# Altium schematic sheet Driver_Esq.SchDoc
size A4; SheetNumber: 1; SheetTotal: 1
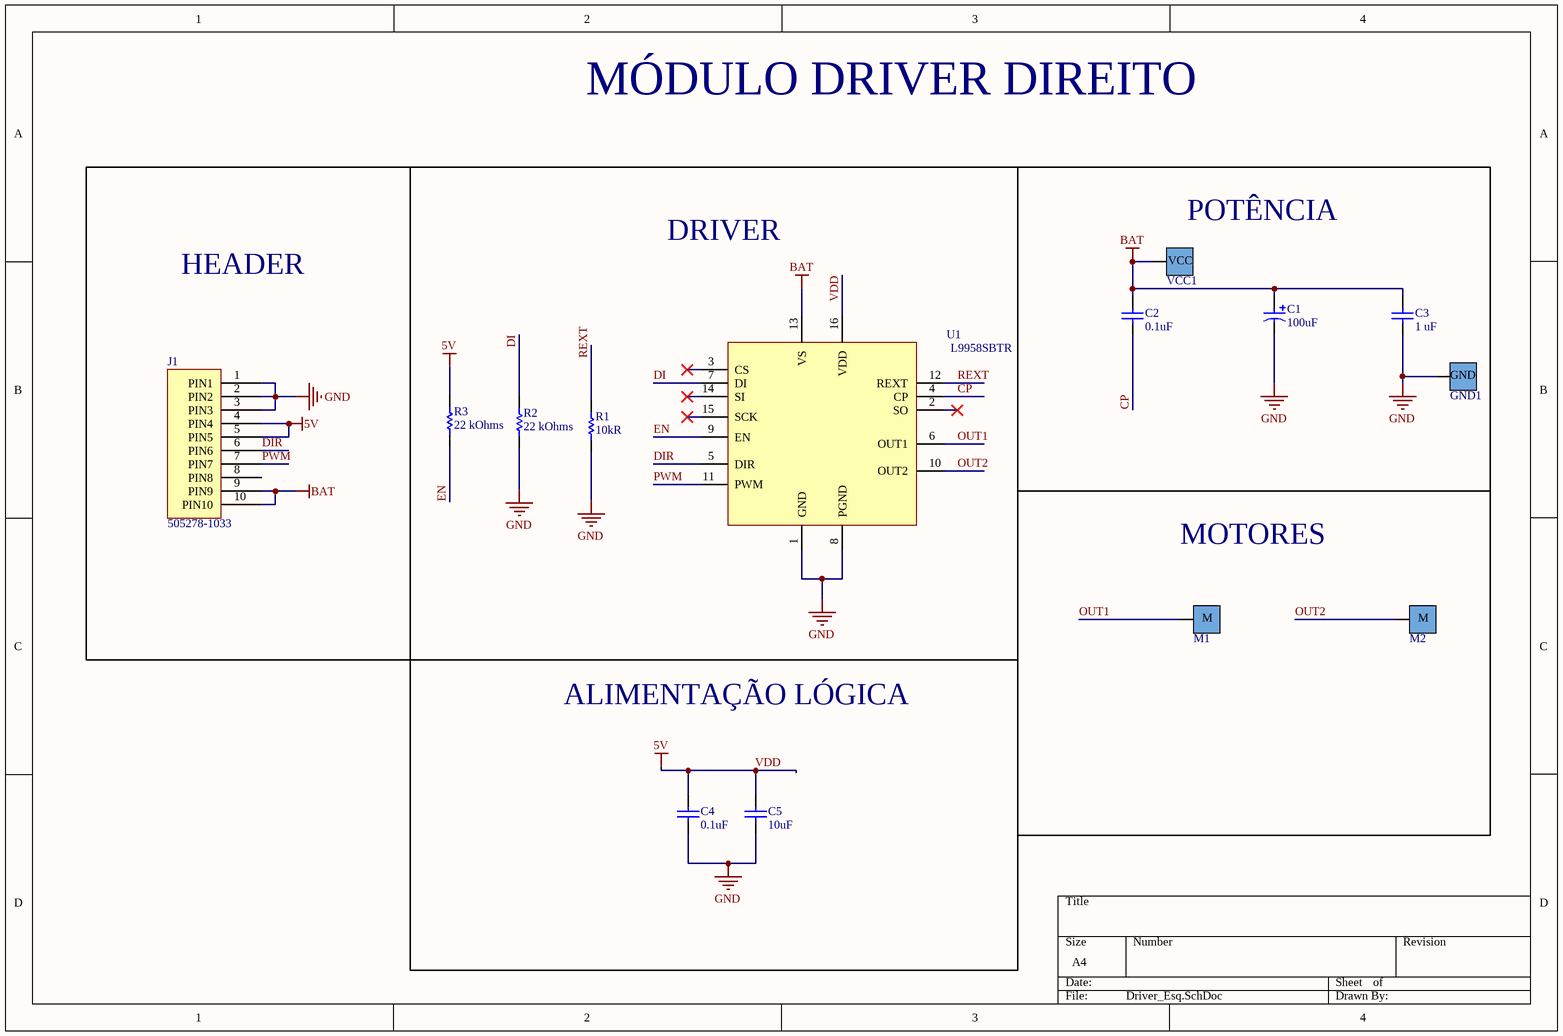
[diagram p0: Driver_Esq.SchDoc]

## Parts
C1  100uF  [TANTALUM C0805]
C2  0.1uF  [C0805]
C3  1 uF  [C0805]
C4  0.1uF  [C0805]
C5  10uF  [C0805]
GND1  Ground Pad  [PAD_ALIMENTAÇÃO_MINI]  (value not drawn)
J1  505278-1033  [FPC_CON]
M1  Motor Pad  [PAD_MOTOR_MINI]  (value not drawn)
M2  Motor Pad  [PAD_MOTOR_MINI]  (value not drawn)
R1  10kR  [RESISTOR_0603]
R2  22 kOhms  [RESISTOR_0603]
R3  22 kOhms  [RESISTOR_0603]
U1  L9958SBTR  [POWERSO16 (16_PINS)]
VCC1  Source Pad  [PAD_ALIMENTAÇÃO_MINI]  (value not drawn)

## Blocks framed on the sheet
MOTORES: M1 M2
ALIMENTAÇÃO LÓGICA: C4 C5

## Nets
BAT: C1.1 C2.1 C3.2 J1.9(PIN9) J1.10(PIN10) U1.13(VS) VCC1.A(VCC)
GND: C1.2 C3.1 C4.2 C5.1 GND1.A(GND) J1.1(PIN1) J1.2(PIN2) J1.3(PIN3) R1.1 R2.1 U1.1(GND) U1.8(PGND)
VDD: C4.1 C5.2 J1.4(PIN4) J1.5(PIN5) R3.1 U1.16(VDD)  [also labelled 5V]
CP: C2.2 U1.4(CP)
DI: R2.2 U1.7(DI)
DIR: J1.6(PIN6) U1.5(DIR)
EN: R3.2 U1.9(EN)
OUT1: M1.M U1.6(OUT1)
OUT2: M2.M U1.10(OUT2)
PWM: J1.7(PIN7) U1.11(PWM)
REXT: R1.2 U1.12(REXT)

Not connected (* = marked no-connect by the designer): J1 8(PIN8); U1 2(SO)* 3(CS)* 14(SI)* 15(SCK)*

## Notes on the sheet
- MÓDULO DRIVER DIREITO
- DRIVER
- (near VCC1) POTÊNCIA
- HEADER

## Library data of the parts
C1 = F980J107MSA: CAP TAN 100uF 6.3V 0805; Manufacturer: AVX; Tolerance: 20%; ESR: 8 Ohms using (100kHz); Dieletric: Tantalum; Library Control - Checked Footprint: Yes; Library Control - Person that Checked Footprint: Nikaum; Supplier 1: Mouser; Part Number: F980J107MSA; Category: Tantalum Capacitor; Price: 1=0.87, 10=0.646, 100=0.443 (USD); Supplier Part Number 1: 581-F980J107MSA; Library Ref: Capacitor; Operating Temperature: -55 C ~ 125 C; Package / Case: 0805 (2012 Metric); Size / Dimension: 2,00 L x 1,25 W x 0,80 H; Value: 100uF; Voltage - Rated: 6.3V; Library Control - Checked Schematic: Yes; Library Control - Last Update: 27/06/2021 23:37; Library Control - Person that Checked Schematic: Nikaum; Library Control - Person that did the Last Update Footprint: Nikaum; Library Control - Person that did the Last Update Schematic: Nikaum; ComponentLink1Description: Datasheet; ComponentLink1URL: https://br.mouser.com/datasheet/2/40/AVX_F98%20DTSH%2008_16-1158749.pdf; ComponentLink2Description: Mouser Link; ComponentLink2URL: https://br.mouser.com/ProductDetail/AVX/F980J107MSA?qs=%2Fha2pyFaduiqmyJM1RWxJ6tWf%252BqxluChd36%252Bz6k56%252ByF7CmEPS5MIQ%3D%3D
C2 C4 = C0805C104M3RACTU: CAP CER 100nF 25V X7R 0805; Manufacturer: Kemet; Tolerance: 20%; Voltage - Rated: 25 VDC; Library Control - Checked Footprint: Yes; Library Control - Person that Checked Footprint: Cage; Supplier 1: Mouser; Part Number: C0805C104M3RACTU; Category: Ceramic Capacitor; Price: 1=0,13 10=0,064 100=0,037 1000=0,025 (USD); Supplier Part Number 1: 80-C0805C104M3R; Library Ref: Capacitor; Operating Temperature: -55 C ~ 125 C; Package / Case: 0805(2012 mestric); Size / Dimension: 1.25 mm W x 2 mm L x 0.78 mm H; Value: 0.1uF; ESR: -; Dieletric: X7R; Library Control - Checked Schematic: Yes; Library Control - Last Update: 25/08/22; Library Control - Person that Checked Schematic: Cage; Library Control - Person that did the Last Update Footprint: Cage; Library Control - Person that did the Last Update Schematic: Cage; ComponentLink1Description: Datasheet; ComponentLink1URL: https://br.mouser.com/datasheet/2/212/KEM_C1002_X7R_SMD-1102033.pdf; ComponentLink2Description: Mouser Link; ComponentLink2URL: https://br.mouser.com/ProductDetail/KEMET/C0805C104M3RACTU?qs=jbCUrP3sAgSIdMuvv9W4Pg%3D%3D
C3 = 08051C105K4T2A: CAP CER 1uF 100V X7R 0805; Manufacturer: KYOCERA AVX; Tolerance: 10%; Voltage - Rated: 100 VDC; Library Control - Checked Footprint: Yes; Supplier 1: Mouser; Part Number: 08051C105K4T2A; Category: Ceramic capacitor; Price: 1=0,41 10=0,283 100=0,169 1000=0,107 (USD); Supplier Part Number 1: 581-08051C105K4T2A; Library Ref: Capacitor; Operating Temperature: -55°C ~125ºC; Package / Case: 0805(2012 Metric); Size / Dimension: 2 mm L  x 1.25 mm W x 1.25 mm H; Value: 1 uF; ESR: -; Dieletric: X7R; Library Control - Checked Schematic: Yes; ComponentLink1Description: Datasheet; ComponentLink1URL: https://br.mouser.com/datasheet/2/40/AutoMLCC-777028.pdf; ComponentLink2Description: Mouser Link; ComponentLink2URL: https://br.mouser.com/ProductDetail/KYOCERA-AVX/08051C105K4T2A?qs=BZBei1rCqCBHLdlOVwQkfA%3D%3D
C5 = EMK212BB7106MG-T: CAP CER 10uF 16V X7R 0805; Manufacturer: Taiyo Yuden; Tolerance: 20%; Voltage - Rated: 16V DC; Library Control - Checked Footprint: Yes; Library Control - Person that Checked Footprint: Cage; Library Control - Person that did the Last Update Footprint: Chico; Supplier 1: Mouser; Part Number: EMK212BB7106MG-T; Category: Ceramic Capacitors; Price: 1=0.42, 10=0.204, 100=0.175 (USD); Supplier Part Number 1: 963-EMK212BB7106MG-T; Library Ref: Capacitor; Operating Temperature: -55°C~+125°C; Package / Case: 0805; Size / Dimension: 1.25mm X 2mm X 1.45mm; Value: 10uF; Dieletric: X7R; Library Control - Checked Schematic: Yes; Library Control - Last Update: 22/08/22; Library Control - Person that Checked Schematic: Cage; Library Control - Person that did the Last Update Schematic: Cage; ComponentLink1Description: Datasheet; ComponentLink1URL: https://br.mouser.com/datasheet/2/396/mlcc02_e-1307760.pdf; ComponentLink2Description: Mouser Link; ComponentLink2URL: https://br.mouser.com/ProductDetail/Taiyo-Yuden/EMK212BB7106MG-T?qs=sGAEpiMZZMsh%252B1woXyUXj9%252BEWUGdOab8mJU%252BgghcgP8%3D
GND1 = Ground Pad Mini Sumô: GND PAD MINI SUMÔ; Cable AWG: 20 / 18 (AWG); Recomended Category: Mini Sumô; Size: 3.5 x 3.5 (mm); Library Ref: Pads
J1 = 505278-1033_BODY: CONN FFC/FPC HORZ 10POS 0.50MM; Manufacturer: Molex; Current Rating (Amps): 500mA; Number of Positions: 10; Library Control - Checked Footprint: Yes; Library Control - Last Project that Used: Follow-Final; Library Control - Person that Checked Footprint: Lucas; Library Control - Person that did the Last Update Footprint: Mateus(Dimas); Supplier 1: Mouser; Part Number: 505278-1033; Category: Connectors; Price: 1=0,51000, 10=0,42900, 100=0,33400 (USD); Mounting Type: Right Angle; Contact Material: Tin; Operating Temperature: -40°C ~ 85°C; Library Ref: Connectors; Number of Rows: 1; Termination: SMD; Insulation Material: Liquid Crystal Polymer; Contact Type: FFC/FPC; Pitch: 0.50mm; Contact Length - Mating: 0.50mm; Supplier Part Number 1: 538-505278-1033; Library Control - Checked Schematic: Yes; Library Control - Last Update: 24/04/2021 00:25; Library Control - Person that Checked Schematic: Lucas; Library Control - Person that did the Last Update Schematic: Mateus(Dimas); ComponentLink1Description: Datasheet; ComponentLink1URL: https://br.mouser.com/datasheet/2/276/2/5052781033_FFC_FPC_CONNECTORS-772019.pdf; ComponentLink2Description: Mouser Link; ComponentLink2URL: https://br.mouser.com/ProductDetail/Molex/505278-1033?qs=c8NFF48pVsDStgrQCBOSTg%3D%3D
M1 M2 = Motor Pad Mini Sumô: Cable AWG: 20 / 18 (AWG); Recomended Category: Mini Sumô; Size: 3.5 x 3.5 (mm); Library Ref: Pads
R1 = RC0603JR-0710KL: RES SMD 10K OHM 5% 1/10W 0603; Manufacturer: Yageo; Temperature Coefficient: 100 PPM / C; Power Rating: 100 mW (1/10 W); Voltage Rating: 75 V; Library Control - Checked Footprint: No; Library Control - Checked Schematic: Yes; Library Control - Person that Checked Schematic: Marcos; Library Control - Person that did the Last Update Footprint: Dalarme; Supplier 1: Mouser; Part Number: RC0603JR-0710KL; Category: Thick Film Resistors - SMD; Price: 1=0,10, 10=0,015, 100=0,005 1000=0,0040 (USD); Package / Case: 0603 (1608 Metric); Operating Temperature: - 55ºC ~ 155ºC; Value: 10kR; Tolerance: 5 %; Library Ref: Resistor; Resistor Type: Fixo; Size / Dimension: 1.6 mm L x  0.8 mm W x  0.45 mm H; Supplier Part Number 1: 603-RC0603JR-0710KL; Library Control - Last Update: 21/06/21 14:15; Library Control - Person that did the Last Update Schematic: Marcos; ComponentLink1Description: Mouser Link; ComponentLink1URL: https://br.mouser.com/ProductDetail/Yageo/RC0603JR-0710KL?qs=ksOUTF%2FWcd8D6T22BJkQ7g%3D%3D; ComponentLink2Description: Datsheet Link; ComponentLink2URL: https://br.mouser.com/datasheet/2/447/Yageo_03_18_2021_PYu_RC_Group_51_RoHS_L_11-2199992.pdf
R2 R3 = CRGH0603F22K: RES SMD 22K OHM 1% 1/5W 0603; Manufacturer: TE Connectivity / Holsworthy; Temperature Coefficient: 100 PPM / C; Power Rating: 200 mW (1/5 W); Voltage Rating: 50 V; Supplier 1: Mouser; Part Number: CRGH0603F22K; Category: Thick Film Resistors; Price: 1= 0.10, 10= 0.07, 100= 0.027 (USD); Package / Case: 0603 (1608 metric); Operating Temperature: -55C~155C; Value: 22 kOhms; Tolerance: 1%; Library Ref: Resistor; Resistor Type: Fixo; Size / Dimension: 0.45 mm x 1.6 mm x 0.8 mm (HxLxW); Supplier Part Number 1: 279-CRGH0603F22K; ComponentLink1Description: Mouser Link; ComponentLink1URL: https://br.mouser.com/ProductDetail/TE-Connectivity-Holsworthy/CRGH0603F22K?qs=j1jvDfvplqKqyIzG56xhJw%3D%3D; ComponentLink2Description: Datasheet; ComponentLink2URL: https://br.mouser.com/datasheet/2/418/6/ENG_DS_1773204_1_F-1140248.pdf
U1 = L9958SBTR: IC MTR DRV (4V ~ 28V) (100 uA) POWERSO 16; Manufacturer: ST; Operating Supply Current: 20 uA; Current - Peak Output (Source/Sink): 5 uA / 100 uA; Current - Output: 100 uA; Voltage - Load: 4V ~ 28V; Voltage - Supply: 4.5 V ~ 5.5 V; Power Dissipation: 625 mW; Rise / Fall Time (Typ): 0.2 us / 3 us; Output Configuration: Half Bridge (2); Logic Voltage - VIL, VIH: VIL = (-0.3 V ~ 0.8 V) / VIH = (2 V ~ VDD + 0.3 V); Library Control - Checked Schematic: Yes; Library Control - Person that Checked Schematic: Pierre; Library Control - Person that did the Last Update Footprint: Stéfany(Ster); Logic (IN-SD/High Low): IN-SD; Rds On - Drain-Source Resistance: 300 mOhms; Category: Driver; Part Number: L9958SBTR; Suplier Part Number 2: L9958SBTR; Price: 1=5,51000, 10=4,95000, 100=4,06000 (USD); Technology: Power MOSFET; Package / Case: POWERSO 16; Operating Temperature: -40°C ~ 150°C; Library Ref: Driver; Library Control - Checked Footprint: Yes; Library Control - Last Update: 21/06/2021 12:25; Library Control - Person that Checked Footprint: Pierre; Library Control - Person that did the Last Update Schematic: Pierre; ComponentLink1Description: Mouser Link / ST Link; ComponentLink1URL: https://estore.st.com/en/l9958sbtr-cpn.html; ComponentLink2Description: Datasheet; ComponentLink2URL: https://www.st.com/resource/en/datasheet/l9958.pdf; Supplier 1: Mouser; Supplier Part Number 1: 511-L9958SBTR
VCC1 = Source Pad Mini Sumô: VCC PAD MINI SUMÔ; Cable AWG: 20 / 18 (AWG); Recomended Category: Mini Sumô; Size: 3.5 x 3.5 (mm); Library Ref: Pads